# EasyEDA Pro project ESPGI-WIN.eprj, board PCB1
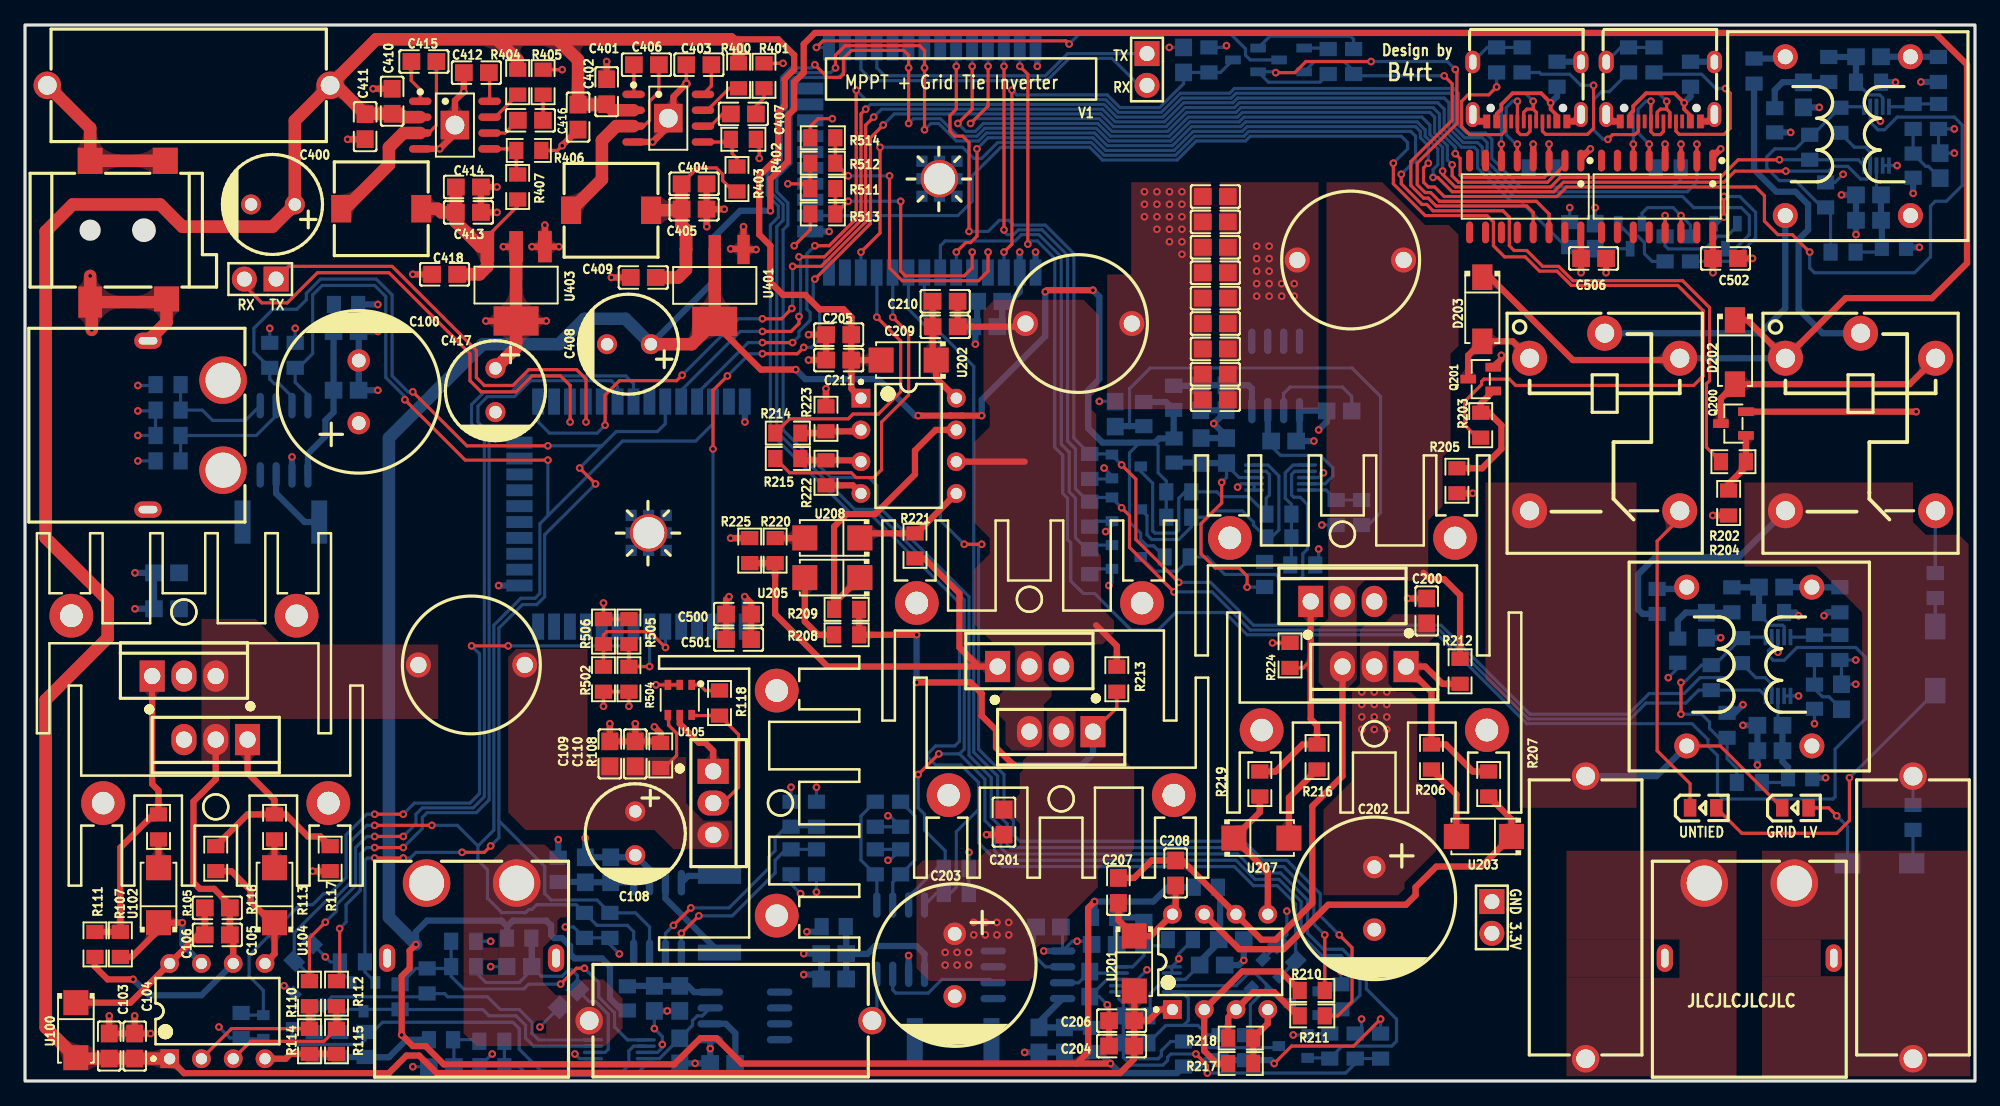
[diagram p6: board, top side]
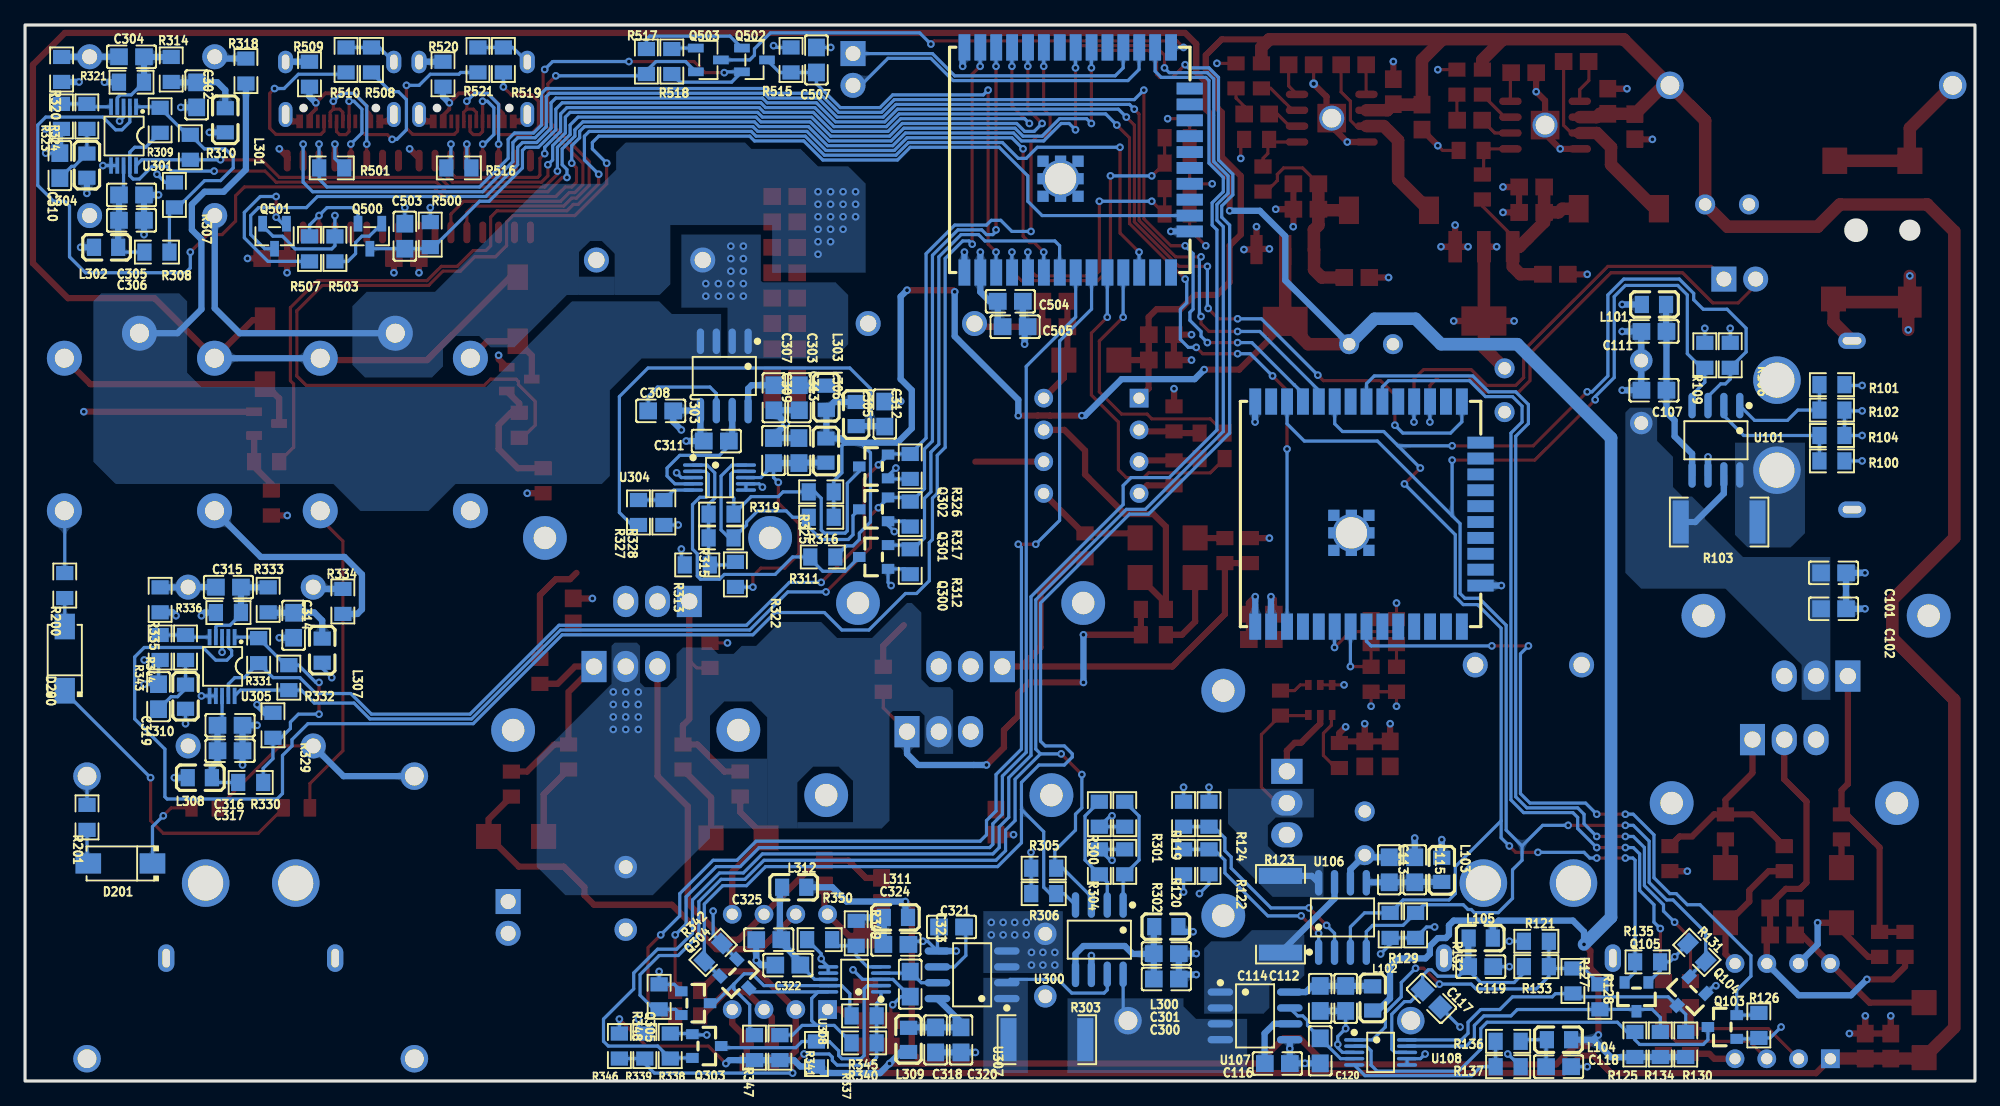
[diagram p7: board, bottom side, seen from below]

Outline 155.83 x 84.46 mm; copper layers: Top Layer, Inner1, Inner2, Bottom Layer. Coordinates in mm from the lower left corner of the outline.
Outline path: rectangle 0,84.46 155.83,0
Stack: Top Layer 0.035mm Outer layer thickness 1oz / Dielectric1 0.2104mm 7628 RC49% 8.6mil / Inner1 0.0152mm Inner layer thickness / Dielectric2 1.065mm 1.1mm H/HOZ Copper / Inner2 0.0152mm Inner layer thickness / Dielectric3 0.2104mm 7628 RC49% 8.6mil / Bottom Layer 0.035mm Outer layer thickness 1oz

## Design rules (mm)
template: JLCPCB Capability(Two Layers Board)
spacing copperThickness1oz (default): track to track 0.102, other pairs 0.152 to 0.3
spacing copperThickness2oz: track to track 0.203, other pairs 0.152 to 0.3
track width copperThickness1oz (default): min 0.127, default 0.254, max 2.54
track width copperThickness2oz: min 0.203, default 0.254, max 2.54
differential pair differentialPair (default): width min 0.127, default 0.254, max 2.54; gap min 0.152, default 0.152
via viaSize (default): diameter min 0.5, default 0.61, max 10; hole min 0.3, default 0.305, max 6.3

## Placement (name value [footprint] x y rotation side)
C100  470uF  [CAP-TH_BD13.0-P5.00-D0.6-FD]  26.67 55.12 90 top
C101  10uF  [C0805]  11.3 40.64 0 bottom
C102  100nF  [C0805]  11.3 37.77 0 bottom
C103  10uF  [C0805]  6.73 2.79 90 top
C104  100nF  [C0805]  8.76 2.79 90 top
C105  NC  [C0805]  15.37 13.84 180 top
C106  1uF  [C0805]  15.37 11.68 180 top
C107  100nF  [C0805]  25.65 55.25 0 bottom
C108  470uF  [CAP-TH_BD8.0-P3.50-D0.6-FD]  48.77 19.81 270 top
C109  22uF  [C0805]  46.74 26.16 90 top
C110  22uF  [C0805]  48.77 26.16 90 top
C111  10uF  [C0805]  25.65 59.94 0 bottom
C112  10uF  [C0805]  50.29 6.6 270 bottom
C113  100nF  [C0805]  46.8 16.89 90 bottom
C114  100nF  [C0805]  52.32 6.6 270 bottom
C115  10uF  [C0805]  44.77 16.89 90 bottom
C116  100nF  [C0805]  55.75 1.4 0 bottom
C117  100nF  [C0805]  43.43 6.6 45 bottom
C118  10uF  [C0805]  33.27 1.14 0 bottom
C119  10uF  [C0805]  39.5 9.14 0 bottom
C120  NC  [C0805]  52.32 2.41 90 bottom
C200  22uF  [C0805]  112.01 37.59 270 top
C201  22uF  [C0805]  78.23 20.7 90 top
C202  470uF  [CAP-TH_BD13.0-P5.00-D0.6-FD]  107.82 14.61 270 top
C203  2200uF  [CAP-TH_BD13.0-P5.00-D0.6-FD]  74.3 9.27 270 top
C204  1uF  [C0805]  87.63 2.79 180 top
C205  1uF  [C0805]  65.02 59.69 180 top
C206  100nF  [C0805]  87.63 4.83 180 top
C207  4.7uF  [C0805]  87.38 15.24 270 top
C208  1uF  [C0805]  91.95 16.64 270 top
C209  1uF  [C0805]  73.53 60.33 180 top
C210  4.7uF  [C0805]  73.53 62.36 180 top
C211  100nF  [C0805]  65.02 57.66 180 top
C212  10uF  [C0805]  95.12 70.74 180 top
C213  10uF  [C0805]  95.12 68.71 180 top
C214  10uF  [C0805]  95.12 66.68 180 top
C215  10uF  [C0805]  95.12 64.64 180 top
C216  10uF  [C0805]  95.12 62.61 180 top
C217  10uF  [C0805]  95.12 60.58 180 top
C218  10uF  [C0805]  95.12 58.55 180 top
C219  10uF  [C0805]  95.12 56.52 180 top
C220  10uF  [C0805]  95.12 54.48 180 top
C300  100nF  [C0805]  64.62 8.16 180 bottom
C301  10uF  [C0805]  64.62 10.19 180 bottom
C302  10uF  [C0805]  142.11 78.87 270 bottom
C303  10uF  [C0805]  93.95 54.64 270 bottom
C304  1uF  [C0805]  147.32 81.92 180 bottom
C305  100nF  [C0805]  147.32 70.87 0 bottom
C306  10uF  [C0805]  147.32 68.83 0 bottom
C307  100nF  [C0805]  95.98 54.64 270 bottom
C308  100nF  [C0805]  105.03 53.59 0 bottom
C309  100nF  [C0805]  96.02 50.42 270 bottom
C310  10uF  [C0805]  153.05 73.21 90 bottom
C311  NC  [C0805]  100.58 51.18 180 bottom
C312  10uF  [C0805]  87.12 53.34 270 bottom
C313  10uF  [C0805]  93.98 50.42 270 bottom
C314  10uF  [C0805]  134.37 36.45 270 bottom
C315  1uF  [C0805]  139.57 39.5 180 bottom
C316  100nF  [C0805]  139.45 28.45 0 bottom
C317  10uF  [C0805]  139.45 26.42 0 bottom
C318  10uF  [C0805]  83.06 3.29 270 bottom
C319  10uF  [C0805]  145.16 30.73 90 bottom
C320  100nF  [C0805]  81.03 3.29 270 bottom
C321  100nF  [C0805]  81.79 12.32 180 bottom
C322  100nF  [C0805]  94.87 9.27 180 bottom
C323  NC  [C0805]  85.09 7.75 90 bottom
C324  10uF  [C0805]  86.23 10.92 0 bottom
C325  10uF  [C0805]  96.39 11.3 180 bottom
C400  100uF  [CAP-TH_BD8.0-P3.50-D0.6-FD]  19.81 70.1 180 top
C401  10uF  [C0805]  46.48 79.12 90 top
C402  10uF  [C0805]  44.2 77.09 270 top
C403  100nF  [C0805]  53.85 81.28 0 top
C404  22uF  [C0805]  53.47 71.76 0 top
C405  22uF  [C0805]  53.47 69.72 0 top
C406  10nF  [C0805]  49.66 81.28 180 top
C407  3.9nF  [C0805]  57.4 77.34 180 top
C408  47uF  [CAP-TH_BD8.0-P3.50-D0.6-FD]  48.26 58.93 180 top
C409  100nF  [C0805]  49.4 64.26 0 top
C410  10uF  [C0805]  29.34 78.36 90 top
C411  10uF  [C0805]  27.18 76.33 270 top
C412  100nF  [C0805]  36.07 80.65 0 top
C413  22uF  [C0805]  35.43 69.47 0 top
C414  22uF  [C0805]  35.43 71.5 0 top
C415  10nF  [C0805]  31.88 81.53 180 top
C416  3.9nF  [C0805]  40.39 76.84 180 top
C417  47uF  [CAP-TH_BD8.0-P3.50-D0.6-FD]  37.59 55.25 270 top
C418  100nF  [C0805]  33.53 64.52 0 top
C500  100nF  [C0805]  57.02 37.34 0 top
C501  22uF  [C0805]  57.02 35.31 0 top
C502  100nF  [C0805]  135.89 65.79 0 top
C503  1uF  [C0805]  125.48 67.56 270 bottom
C504  100nF  [C0805]  77.09 62.36 180 bottom
C505  22uF  [C0805]  76.71 60.33 180 bottom
C506  100nF  [C0805]  125.35 65.79 0 top
C507  1uF  [C0805]  92.58 81.66 270 bottom
D200  1N4007  [SMA_L4.4-W2.8-LS5.4-RD]  152.65 33.78 90 bottom
D201  1N4007  [SMA_L4.4-W2.8-LS5.4-RD]  148.21 17.4 0 bottom
D202  1N4007  [SMA_L4.4-W2.8-LS5.4-RD]  136.65 58.29 270 top
D203  1N4007  [SMA_L4.4-W2.8-LS5.4-RD]  116.46 61.72 270 top
DC400  DC050-T  [DC-IN_DC050-T]  8.25 67.95 0 top
FH100  PTF-15  [FUSE-TH_L22.0-W9.0-P22.60]  56.39 4.83 0 top
FH200  PTF-15  [FUSE-TH_L22.0-W9.0-P22.60]  150.88 13.08 270 top
FH201  PTF-15  [FUSE-TH_L22.0-W9.0-P22.60]  124.71 13.08 270 top
FH400  PTF-15  [FUSE-TH_L22.0-W9.0-P22.60]  13.08 79.63 180 top
H500  PZ254V-11-02P  [HDR-TH_2P-P2.54-V-M]  18.8 64.14 180 top
H501  PZ254V-11-02P  [HDR-TH_2P-P2.54-V-M]  89.66 80.9 270 top
H502  PZ254V-11-02P  [HDR-TH_2P-P2.54-V-M]  117.22 13.08 270 top
L100  120uH  [IND-TH_XR6826T471MHL6]  35.69 33.27 0 top
L101  10uH  [L0805]  25.65 62.1 0 bottom
L102  10uH  [L0805]  48.13 6.6 270 bottom
L103  10uH  [L0805]  42.61 16.89 90 bottom
L104  10uH  [L0805]  33.24 3.3 180 bottom
L105  10uH  [L0805]  39.5 11.43 180 bottom
L200  200uH  [IND-TH_XR6826T471MHL6]  105.92 65.66 180 top
L201  0uH  [IND-TH_XR6826T471MHL6]  84.2 60.58 0 top
L300  10uH  [L0805]  64.62 12.35 180 bottom
L301  10uH  [L0805]  139.83 76.84 270 bottom
L302  10uH  [L0805]  149.35 66.68 0 bottom
L303  10uH  [L0805]  91.79 54.64 270 bottom
L304  10uH  [L0805]  150.89 73.21 270 bottom
L305  10uH  [L0805]  89.41 53.34 90 bottom
L306  10uH  [L0805]  91.83 50.42 90 bottom
L307  10uH  [L0805]  132.08 34.42 270 bottom
L308  10uH  [L0805]  141.86 24.26 0 bottom
L309  10uH  [L0805]  85.22 3.29 270 bottom
L310  10uH  [L0805]  143 30.73 270 bottom
L311  10uH  [L0805]  86.23 13.08 180 bottom
L312  10uH  [L0805]  94.36 15.49 180 bottom
L400  10uH  [IND-SMD_L7.5-W7.5]  46.83 69.64 180 top
L401  10uH  [IND-SMD_L7.5-W7.5]  28.47 69.76 180 top
LED200  red  [LED0805-R-RD]  134.11 21.84 0 top
LED201  green  [LED0805-R-RD]  141.48 21.84 0 top
Q100  IRL540NPBF  [TO-220-3_L10.0-W4.5-P2.54-T]  12.7 32.39 90 top
Q101  IRL540NPBF  [TO-220-3_L10.0-W4.5-P2.54-T]  54.99 22.23 0 top
Q102  IRL540NPBF  [TO-220-3_L10.0-W4.5-P2.54-T]  15.24 27.31 270 top
Q103  BSS138  [SOT-23_L2.9-W1.3-P1.90-LS2.4-BR]  20.19 4.32 180 bottom
Q104  BSS138  [SOT-23_L2.9-W1.3-P1.90-LS2.4-BR]  22.99 6.86 135 bottom
Q105  BSS138  [SOT-23_L2.9-W1.3-P1.90-LS2.4-BR]  27.05 6.73 90 bottom
Q200  BC847  [SOT-23-3_L2.9-W1.3-P1.90-LS2.4-BR]  136.52 52.58 0 top
Q201  BC847  [SOT-23-3_L2.9-W1.3-P1.90-LS2.4-BR]  116.33 56.13 0 top
Q202  IRL540NPBF  [TO-220-3_L10.0-W4.5-P2.54-T]  107.82 33.15 270 top
Q203  IRL540NPBF  [TO-220-3_L10.0-W4.5-P2.54-T]  82.8 27.94 270 top
Q204  IRL540NPBF  [TO-220-3_L10.0-W4.5-P2.54-T]  105.28 38.35 90 top
Q205  IRL540NPBF  [TO-220-3_L10.0-W4.5-P2.54-T]  80.26 33.15 90 top
Q300  BSS138  [SOT-23_L2.9-W1.3-P1.90-LS2.4-BR]  88.01 41.91 180 bottom
Q301  BSS138  [SOT-23_L2.9-W1.3-P1.90-LS2.4-BR]  88.01 45.72 180 bottom
Q302  BSS138  [SOT-23_L2.9-W1.3-P1.90-LS2.4-BR]  88.01 49.15 180 bottom
Q303  BSS138  [SOT-23_L2.9-W1.3-P1.90-LS2.4-BR]  101.35 2.79 0 bottom
Q304  BSS138  [SOT-23_L2.9-W1.3-P1.90-LS2.4-BR]  98.81 8.25 45 bottom
Q305  BSS138  [SOT-23_L2.9-W1.3-P1.90-LS2.4-BR]  102.23 6.22 0 bottom
Q500  BC847  [SOT-23-3_L2.9-W1.3-P1.90-LS2.4-BR]  128.27 67.56 90 bottom
Q501  BC847  [SOT-23-3_L2.9-W1.3-P1.90-LS2.4-BR]  135.89 67.56 90 bottom
Q502  BC847  [SOT-23-3_L2.9-W1.3-P1.90-LS2.4-BR]  97.54 81.66 0 bottom
Q503  BC847  [SOT-23-3_L2.9-W1.3-P1.90-LS2.4-BR]  101.22 81.66 0 bottom
R100  NC  [R0805]  11.43 49.59 0 bottom
R101  NC  [R0805]  11.43 55.69 0 bottom
R102  10k  [R0805]  11.43 53.66 0 bottom
R103  0.05  [R2512]  20.45 44.7 180 bottom
R104  10k  [R0805]  11.43 51.62 0 bottom
R105  0  [R0805]  10.67 20.32 90 top
R106  10k  [R0805]  19.56 58.04 270 bottom
R107  10  [R0805]  7.62 10.92 90 top
R108  NC  [R0805]  50.8 26.04 270 top
R109  10k  [R0805]  21.59 58.04 270 bottom
R110  0  [R0805]  22.73 6.99 270 top
R111  NC  [R0805]  5.59 10.92 90 top
R112  0  [R0805]  24.89 6.99 270 top
R113  0  [R0805]  19.94 20.32 90 top
R114  NC  [R0805]  22.73 3.18 90 top
R115  NC  [R0805]  24.89 3.18 90 top
R116  10  [R0805]  15.24 17.78 90 top
R117  NC  [R0805]  24.38 17.78 90 top
R118  100  [R0805]  55.5 30.23 90 top
R119  NC  [R0805]  63.25 21.34 270 bottom
R120  10k  [R0805]  63.25 17.53 90 bottom
R121  10k  [R0805]  35.05 11.18 180 bottom
R122  NC  [R0805]  61.21 17.53 90 bottom
R123  0.02  [R2512]  55.5 13.34 90 bottom
R124  10k  [R0805]  61.21 21.34 270 bottom
R125  10k  [R0805]  27.18 2.92 270 bottom
R126  10k  [R0805]  17.27 4.44 270 bottom
R127  NC  [R0805]  32.13 8 270 bottom
R128  NC  [R0805]  29.97 6.73 90 bottom
R129  10k  [R0805]  46.74 12.45 90 bottom
R130  10k  [R0805]  23.11 2.92 270 bottom
R131  10k  [R0805]  22.22 10.29 45 bottom
R132  10k  [R0805]  44.7 12.45 90 bottom
R133  NC  [R0805]  35.05 9.14 180 bottom
R134  10k  [R0805]  25.15 2.92 270 bottom
R135  10k  [R0805]  26.16 9.53 180 bottom
R136  10k  [R0805]  37.31 3.18 180 bottom
R137  10k  [R0805]  37.31 1.14 180 bottom
R200  2k  [R0805]  152.65 39.62 90 bottom
R201  2k  [R0805]  150.88 21.08 90 bottom
R202  1k  [R0805]  136.52 49.53 0 top
R203  1k  [R0805]  116.33 52.45 90 top
R204  10k  [R0805]  136.14 46.23 90 top
R205  10k  [R0805]  114.43 48.01 90 top
R206  0  [R0805]  112.39 25.91 90 top
R207  10  [R0805]  116.97 23.75 90 top
R208  0  [R0805]  65.66 35.69 0 top
R209  10  [R0805]  65.66 37.72 0 top
R210  0  [R0805]  102.87 7.24 180 top
R211  0  [R0805]  102.87 5.21 180 top
R212  NC  [R0805]  114.68 32.77 270 top
R213  NC  [R0805]  87.25 32.13 270 top
R214  0  [R0805]  60.96 51.82 0 top
R215  0  [R0805]  60.96 49.78 0 top
R216  0  [R0805]  103.25 25.91 90 top
R217  NC  [R0805]  97.15 1.4 180 top
R218  NC  [R0805]  97.15 3.43 180 top
R219  10  [R0805]  98.68 23.75 90 top
R220  0Ω  [R0805]  59.94 42.42 270 top
R221  10  [R0805]  71.12 42.8 270 top
R222  NC  [R0805]  64.01 48.64 90 top
R223  NC  [R0805]  64.01 52.96 270 top
R224  NC  [R0805]  101.09 34.04 270 top
R225  NC  [R0805]  57.91 42.42 270 top
R300  NC  [R0805]  69.98 21.34 90 bottom
R301  10k  [R0805]  67.95 21.34 90 bottom
R302  NC  [R0805]  67.95 17.53 270 bottom
R303  0.02  [R2512]  74.17 3.3 180 bottom
R304  10k  [R0805]  69.98 17.53 270 bottom
R305  10k  [R0805]  74.42 17.02 180 bottom
R306  10k  [R0805]  74.42 14.99 180 bottom
R307  NC  [R0805]  143.89 70.87 270 bottom
R308  10k  [R0805]  145.29 66.29 0 bottom
R309  NC  [R0805]  145.03 76.84 90 bottom
R310  NC  [R0805]  142.62 74.68 90 bottom
R311  10k  [R0805]  92.08 41.91 180 bottom
R312  10k  [R0805]  85.09 41.53 270 bottom
R313  NC  [R0805]  102.11 41.28 180 bottom
R314  100k  [R0805]  144.14 80.9 90 bottom
R315  NC  [R0805]  100.2 43.43 180 bottom
R316  10k  [R0805]  92.2 45.09 180 bottom
R317  10k  [R0805]  85.09 45.34 270 bottom
R318  5k  [R0805]  138.18 80.77 270 bottom
R319  10k  [R0805]  100.2 45.34 0 bottom
R320  750  [R0805]  152.91 80.9 270 bottom
R321  100k  [R0805]  147.32 79.88 0 bottom
R322  NC  [R0805]  99.06 40.51 90 bottom
R323  100k  [R0805]  152.92 77.15 270 bottom
R324  100k  [R0805]  150.89 77.15 270 bottom
R325  10k  [R0805]  92.2 47.12 180 bottom
R326  10k  [R0805]  85.09 49.15 270 bottom
R327  10k  [R0805]  106.81 45.47 270 bottom
R328  10k  [R0805]  104.77 45.47 270 bottom
R329  NC  [R0805]  136.02 28.45 270 bottom
R330  NC  [R0805]  137.8 23.88 0 bottom
R331  NC  [R0805]  137.16 34.42 90 bottom
R332  10k  [R0805]  134.75 32.26 90 bottom
R333  100k  [R0805]  136.4 38.48 90 bottom
R334  5k  [R0805]  130.43 38.35 270 bottom
R335  750  [R0805]  145.03 38.48 270 bottom
R336  100k  [R0805]  139.57 37.47 0 bottom
R337  10k  [R0805]  92.58 2.16 270 bottom
R338  10k  [R0805]  104.27 2.79 90 bottom
R339  10k  [R0805]  106.3 2.79 270 bottom
R340  NC  [R0805]  88.77 3.05 0 bottom
R341  10k  [R0805]  95.5 2.67 270 bottom
R342  10k  [R0805]  100.84 10.29 135 bottom
R343  100k  [R0805]  145.03 34.67 270 bottom
R344  100k  [R0805]  143 34.67 270 bottom
R345  NC  [R0805]  88.77 5.21 180 bottom
R346  NC  [R0805]  108.33 2.79 270 bottom
R347  10k  [R0805]  97.54 2.67 270 bottom
R348  10k  [R0805]  105.16 6.73 90 bottom
R349  10k  [R0805]  89.41 11.81 90 bottom
R350  10k  [R0805]  92.33 11.3 0 bottom
R400  100k  [R0805]  57.02 80.39 90 top
R401  6.8k  [R0805]  59.05 80.39 270 top
R402  10k  [R0805]  57.4 75.31 0 top
R403  60k  [R0805]  56.9 72.14 270 top
R404  100k  [R0805]  39.37 79.88 90 top
R405  6.8k  [R0805]  41.4 79.88 270 top
R406  10k  [R0805]  40.26 74.42 0 top
R407  42.2k  [R0805]  39.37 71.5 270 top
R500  10k  [R0805]  123.44 67.69 270 bottom
R501  10k  [R0805]  131.32 73.03 0 bottom
R502  NTC  [R0805]  46.23 32.13 270 top
R503  10k  [R0805]  131.06 66.55 270 bottom
R504  NTC  [R0805]  48.26 32.13 270 top
R505  10k  [R0805]  48.26 35.94 90 top
R506  10k  [R0805]  46.23 35.94 90 top
R507  10k  [R0805]  133.1 66.55 270 bottom
R508  5.1k  [R0805]  128.14 81.66 270 bottom
R509  NC  [R0805]  133.1 80.52 270 bottom
R510  5.1k  [R0805]  130.18 81.66 270 bottom
R511  NTC  [R0805]  63.75 71.37 0 top
R512  NTC  [R0805]  63.75 73.41 0 top
R513  10k  [R0805]  63.75 69.34 180 top
R514  10k  [R0805]  63.75 75.44 180 top
R515  10k  [R0805]  94.61 81.66 270 bottom
R516  10k  [R0805]  121.16 73.03 0 bottom
R517  10k  [R0805]  106.17 81.53 90 bottom
R518  10k  [R0805]  104.14 81.53 90 bottom
R519  5.1k  [R0805]  117.6 81.66 270 bottom
R520  NC  [R0805]  122.43 80.52 270 bottom
R521  5.1k  [R0805]  119.63 81.66 270 bottom
RLY200  SRD-05VDC-SL-C  [RELAY-TH_SRD-XXVDC-XL-C]  146.69 52.71 270 top
RLY201  SRD-05VDC-SL-C  [RELAY-TH_SRD-XXVDC-XL-C]  126.24 52.71 270 top
U100  SS34  [SMA_L4.3-W2.6-LS5.1-RD]  4.06 4.06 270 top
U101  INA219BID  [SOIC-8_L4.9-W3.9-P1.27-LS6.0-BL]  20.7 51.24 0 bottom
U102  SS34  [SMA_L4.3-W2.6-LS5.1-RD]  10.67 14.86 90 top
U103  IR2103PBF  [DIP-8_L9.8-W6.6-P2.54-LS7.6-BL]  15.37 5.59 0 top
U104  SS34  [SMA_L4.3-W2.6-LS5.1-RD]  19.94 14.86 90 top
U105  LM5050MK-1/NOPB  [TSOT-23-6_L2.9-W1.6-P0.95-LS2.8-BR]  52.32 30.48 90 top
U106  INA219BID  [SOIC-8_L4.9-W3.9-P1.27-LS6.0-BL]  50.55 13.08 180 bottom
U107  ACS724LLCTR-05AB-T  [SOIC-8_L4.9-W3.9-P1.27-LS6.0-BL]  57.53 5.21 270 bottom
U108  ADS1115IDGSR  [MSOP-10_L3.0-W3.0-P0.50-LS5.0-BL]  47.5 2.29 270 bottom
U109  XT60PW-F  [TH_2P-XT60PW-F]  12.83 52.45 90 top
U110  XT60PW-F  [TH_2P-XT60PW-F]  35.69 12.83 180 top
U200  XT60PW-F  [TH_2P-XT60PW-F]  137.8 12.83 180 top
U201  SS34  [SMA_L4.3-W2.6-LS5.1-RD]  88.65 9.4 270 top
U202  SS34  [SMA_L4.3-W2.6-LS5.1-RD]  70.61 57.66 180 top
U203  SS34  [SMA_L4.3-W2.6-LS5.1-RD]  116.59 19.56 180 top
U204  IR2103PBF  [DIP-8_L9.8-W6.6-P2.54-LS7.6-BL]  95.5 9.53 0 top
U205  SS34  [SMA_L4.3-W2.6-LS5.1-RD]  64.52 40.26 180 top
U206  IR2103PBF  [DIP-8_L9.8-W6.6-P2.54-LS7.6-BL]  70.61 50.8 270 top
U207  SS34  [SMA_L4.3-W2.6-LS5.1-RD]  98.81 19.43 0 top
U208  SS34  [SMA_L4.3-W2.6-LS5.1-RD]  64.52 43.43 180 top
U300  INA219BID  [SOIC-8_L4.9-W3.9-P1.27-LS6.0-BL]  69.98 11.3 0 bottom
U301  ADS1015IDGST  [VSSOP-10_L3.0-W3.0-P0.50-LS4.9-BL]  147.95 75.57 0 bottom
U302  ZMPT101B  [XFMR-TH_ZMPT101B]  145.67 75.57 0 top
U303  ACS724LLCTR-10AB-T  [SOIC-8_L4.9-W3.9-P1.27-LS6.0-BL]  99.95 56.39 0 bottom
U304  ADS1115IDGSR  [MSOP-10_L3.0-W3.0-P0.50-LS5.0-BL]  100.33 48.26 270 bottom
U305  ADS1015IDGST  [VSSOP-10_L3.0-W3.0-P0.50-LS4.9-BL]  140.08 33.15 0 bottom
U306  ZMPT101B  [XFMR-TH_ZMPT101B]  137.8 33.15 0 top
U307  ACS724LLCTR-10AB-T  [SOIC-8_L4.9-W3.9-P1.27-LS6.0-BL]  80.14 8.49 90 bottom
U308  ADS1115IDGSR  [MSOP-10_L3.0-W3.0-P0.50-LS5.0-BL]  89.53 8.13 90 bottom
U400  MP2307DN-LF-Z  [SOP-8_L4.9-W3.9-P1.27-LS6.0-BL-EP]  51.4 77 270 top
U401  AMS1117-5.0  [SOT-223-3_L6.7-W3.7-P2.30-LS7.0-BR]  55.12 63.63 90 top
U402  MP2307DN-LF-Z  [SOP-8_L4.9-W3.9-P1.27-LS6.0-BL-EP]  34.36 76.45 270 top
U403  AMS1117-3.3  [SOT-223-3_L6.5-W3.4-P2.30-LS7.0-BR]  39.24 63.75 90 top
U500  ESP32-WROOM-32E-N4  [WIFI-SMD_ESP32-WROOM-32E]  48.51 45.34 180 bottom
U501  CH340C  [SOP-16_L10.0-W3.9-P1.27-LS6.0-BL]  130.43 70.74 180 top
U502  ESP32-WROOM-32E-N4  [WIFI-SMD_ESP32-WROOM-32E]  71.75 73.66 180 bottom
U503  CH340C  [SOP-16_L10.0-W3.9-P1.27-LS6.0-BL]  119.89 70.74 180 top
U504  -  [HEATSINK-TH_L23.5-W16.0-P18.0_XSD2156-067]  12.7 37.21 0 top
U504#2  -  [HEATSINK-TH_L23.5-W16.0-P18.0_XSD2156-067]  15.24 22.23 180 top
U504#3  -  [HEATSINK-TH_L23.5-W16.0-P18.0_XSD2156-067]  105.28 43.43 0 top
U504#4  -  [HEATSINK-TH_L23.5-W16.0-P18.0_XSD2156-067]  107.82 28.07 180 top
U504#5  -  [HEATSINK-TH_L23.5-W16.0-P18.0_XSD2156-067]  82.8 22.86 180 top
U504#6  -  [HEATSINK-TH_L23.5-W16.0-P18.0_XSD2156-067]  80.26 38.23 0 top
U504#7  -  [HEATSINK-TH_L23.5-W16.0-P18.0_XSD2156-067]  60.07 22.23 270 top
USB500  TYPE-C 16PIN 2MD(073)  [USB-C-SMD_TYPE-C-6PIN-2MD-073]  130.68 79.12 180 top
USB501  TYPE-C 16PIN 2MD(073)  [USB-C-SMD_TYPE-C-6PIN-2MD-073]  120.02 79.12 180 top

## Footprints (pads in the part's own frame, mm; a bottom-side part is the same pattern mirrored in y, then rotated)
C0805
  rect 1.41x1.35 smd: 1(-1,0) 2(1,0)
CAP-TH_BD8.0-P3.50-D0.6-FD
  round 1.6 hole 1: 1(-1.75,0) 2(1.75,0)
CAP-TH_BD13.0-P5.00-D0.6-FD
  round 1.8 hole 1.1: 1(-2.5,0) 2(2.5,0)
DC-IN_DC050-T
  rect 2x2.1 smd: 1(-3.05,5.65) 1(2.95,5.65)
  rect 1.9x2.5 smd: 2(-3.05,-5.65)
  rect 2x2 smd: 3(3.05,-5.4)
DIP-8_L9.8-W6.6-P2.54-LS7.6-BL
  rect 1.5x1.5 hole 0.9: 1(-3.81,-3.81)
  round 1.5 hole 0.9: 2(-1.27,-3.81) 3(1.27,-3.81) 4(3.81,-3.81) 5(3.81,3.81) 6(1.27,3.81) 7(-1.27,3.81) 8(-3.81,3.81)
FUSE-TH_L22.0-W9.0-P22.60
  round 2.2 hole 1.5: 1(-11.3,0) 2(11.3,0)
HDR-TH_2P-P2.54-V-M
  rect 2x2 hole 1.2: 1(-1.27,0)
  round 2 hole 1.2: 2(1.27,0)
HEATSINK-TH_L23.5-W16.0-P18.0_XSD2156-067
  round 3.5 hole 1.8: 1(-9,0) 2(9,0)
IND-SMD_L7.5-W7.5
  rect 1.6x2.2 smd: 1(-3.2,0) 2(3.2,0)
IND-TH_XR6826T471MHL6
  round 2 hole 1.3: 1(-4.25,0) 2(4.25,0)
L0805
  rect 1.133x1.377 smd: 1(-0.966,0) 2(0.966,0)
LED0805-R-RD
  rect 1x1.399 smd: 1(1.05,0) 2(-1.05,0)
MSOP-10_L3.0-W3.0-P0.50-LS5.0-BL
  oval 0.28x1.62 smd: 1(-1,-2.11) 2(-0.5,-2.11) 3(0,-2.11) 4(0.5,-2.11) 5(1,-2.11) 6(1,2.11) 7(0.5,2.11) 8(0,2.11) 9(-0.5,2.11) 10(-1,2.11)
R0805
  rect 1.133x1.377 smd: 1(-1,0) 2(1,0)
R2512
  rect 1.282x3.456 smd: 1(-3.067,0) 2(3.067,0)
RELAY-TH_SRD-XXVDC-XL-C
  round 2.794 hole 1.524: 1(-5.1,-6) 2(7.1,-6) 3(7.1,6) 4(-5.1,6) 5(-7.1,0)
SMA_L4.3-W2.6-LS5.1-RD
  rect 2x2 smd: 1(-2.2,0) 2(2.2,0)
SMA_L4.4-W2.8-LS5.4-RD
  rect 2.046x1.62 smd: 1(-2.566,0) 2(2.566,0)
SOIC-8_L4.9-W3.9-P1.27-LS6.0-BL
  oval 0.588x2.045 smd: 1(-1.905,-2.772) 2(-0.635,-2.772) 3(0.635,-2.772) 4(1.905,-2.772) 5(1.905,2.772) 6(0.635,2.772) 7(-0.635,2.772) 8(-1.905,2.772)
SOP-8_L4.9-W3.9-P1.27-LS6.0-BL-EP
  oval 0.6x1.8 smd: 1(-1.905,-2.772) 2(-0.635,-2.772) 3(0.635,-2.772) 4(1.905,-2.772) 5(1.905,2.772) 6(0.635,2.772) 7(-0.635,2.772) 8(-1.905,2.772)
  rect 2.29x2.29 smd: 9(0,0)
  round 2 hole 1.5: 10(0,0)
SOP-16_L10.0-W3.9-P1.27-LS6.0-BL
  oval 0.56x1.745 smd: 1(-4.445,-2.873) 2(-3.175,-2.873) 3(-1.905,-2.873) 4(-0.635,-2.873) 5(0.635,-2.873) 6(1.905,-2.873) 7(3.175,-2.873) 8(4.445,-2.873) 9(4.445,2.873) 10(3.175,2.873) 11(1.905,2.873) 12(0.635,2.873) 13(-0.635,2.873) 14(-1.905,2.873) 15(-3.175,2.873) 16(-4.445,2.873)
SOT-23-3_L2.9-W1.3-P1.90-LS2.4-BR
  rect 1.25x0.7 smd: 1(1,-0.95) 2(1,0.95) 3(-1,0)
SOT-23_L2.9-W1.3-P1.90-LS2.4-BR
  rect 1x0.8 smd: 1(1.15,-0.95) 2(1.15,0.95) 3(-1.15,0)
SOT-223-3_L6.5-W3.4-P2.30-LS7.0-BR
  rect 2.5x1.1 smd: 1(2.97,-2.3) 2(2.97,0) 3(2.97,2.3)
  rect 2.34x3.6 smd: 4(-2.97,0)
SOT-223-3_L6.7-W3.7-P2.30-LS7.0-BR
  rect 2.34x0.98 smd: 1(2.87,-2.3) 2(2.87,0) 3(2.87,2.3)
  rect 2.34x3.6 smd: 4(-2.87,0)
TH_2P-XT60PW-F
  oval 1.3x2.2 hole 0.6x1.5: 1(-6.75,3) 2(6.75,3)
  round 3.8 hole 2.8: 3(-3.6,-3) 4(3.6,-3)
TO-220-3_L10.0-W4.5-P2.54-T
  rect 2.5x2 hole 1.3: 1(0,2.54)
  oval 2.5x2 hole 1.3: 2(0,0) 3(0,-2.54)
TSOT-23-6_L2.9-W1.6-P0.95-LS2.8-BR
  rect 0.8x0.532 smd: 1(1.2,-0.95) 2(1.2,0) 3(1.2,0.95) 4(-1.2,0.95) 5(-1.2,0) 6(-1.2,-0.95)
USB-C-SMD_TYPE-C-6PIN-2MD-073
  rect 0.55x1.1 smd: 1(-3.2,2.375) 2(-2.4,2.375) 11(2.4,2.375) 12(3.2,2.375)
  rect 0.3x1.1 smd: 3(-1.75,2.375) 4(-1.25,2.375) 5(-0.75,2.375) 6(-0.25,2.375) 7(0.25,2.375) 8(0.75,2.375) 9(1.25,2.375) 10(1.75,2.375)
  oval 1.1x2 hole 0.6x1.5: 13(-4.325,1.825) 14(4.325,1.825)
  oval 1.2x1.8 hole 0.6x1.2: 13(-4.325,-2.375) 14(4.325,-2.375)
VSSOP-10_L3.0-W3.0-P0.50-LS4.9-BL
  rect 0.3x1.3 smd: 1(-1,-2.35) 2(-0.5,-2.35) 3(0,-2.35) 4(0.5,-2.35) 5(1,-2.35) 6(1,2.35) 7(0.5,2.35) 8(0,2.35) 9(-0.5,2.35) 10(-1,2.35)
WIFI-SMD_ESP32-WROOM-32E
  rect 0.95x2.1 smd: 1(-9.002,-9) 2(-7.732,-9) 3(-6.463,-9) 4(-5.192,-9) 5(-3.922,-9) 6(-2.652,-9) 7(-1.383,-9) 8(-0.113,-9) 9(1.157,-9) 10(2.428,-9) 11(3.697,-9) 12(4.968,-9) 13(6.237,-9) 14(7.508,-9) 25(7.508,9) 26(6.237,9) 27(4.968,9) 28(3.697,9) 29(2.428,9) 30(1.157,9) 31(-0.113,9) 32(-1.383,9) 33(-2.652,9) 34(-3.922,9) 35(-5.192,9) 36(-6.463,9) 37(-7.732,9) 38(-9.002,9)
  rect 2.1x0.95 smd: 15(9.002,-5.715) 16(9.002,-4.445) 17(9.002,-3.175) 18(9.002,-1.905) 19(9.002,-0.635) 20(9.002,0.635) 21(9.002,1.905) 22(9.002,3.175) 23(9.002,4.445) 24(9.002,5.715)
  rect 0.9x0.9 smd: 39(-2.721,-2.9) 39(-2.721,-1.5) 39(-2.721,-0.1) 39(-1.321,-2.9) 39(-1.321,-1.5) 39(-1.321,-0.1) 39(0.079,-2.9) 39(0.079,-1.5) 39(0.079,-0.1)
  round 3 hole 2.5: 40(-1.319,-1.5)
XFMR-TH_ZMPT101B
  round 2 hole 1.2: 1(-5,6.35) 2(-5,-6.35) 3(5,-6.35) 4(5,6.35)

## Nets
As in the schematic, except:
+3.3V: C417.1 C500.1 C501.1 C502.1 C504.1 C505.1 C506.1 H502.2 L101.2 L103.2 L300.2 L301.2 L302.2 L304.2 L307.2 L308.2 L310.2 Q103.1 Q104.1 Q105.1 Q300.1 Q301.1 Q302.1 Q303.1 Q304.1 Q305.1 R100.1 R101.1 R106.1 R109.1 R119.1 R120.1 R126.2 R129.1 R131.2 R132.1 R135.2 R300.1 R301.1 R305.1 R306.1 R312.2 R317.2 R326.2 R338.2 R342.2 R348.2 R500.1 R501.1 R502.2 R504.2 R511.1 R512.1 R515.1 R516.1 U403.2 U403.4 U500.2 U501.4 U501.16 U502.2 U503.4 U503.16
GND: C100.2 C101.1 C102.1 C103.2 C104.2 C107.2 C108.2 C109.2 C110.2 C111.2 C112.2 C113.2 C114.2 C115.2 C116.1 C117.1 C118.1 C119.1 C120.1 C200.1 C201.1 C202.2 C203.2 C204.2 C205.2 C206.2 C211.2 C300.2 C301.2 C302.2 C303.2 C305.1 C306.1 C307.2 C308.1 C309.1 C310.2 C311.1 C312.1 C313.1 C314.2 C316.1 C317.1 C318.2 C319.2 C320.2 C321.1 C322.1 C323.1 C324.1 C325.1 C400.2 C401.2 C402.2 C403.1 C404.2 C405.2 C409.1 C410.2 C411.2 C412.1 C413.2 C414.2 C417.2 C418.1 C500.2 C501.2 C502.2 C503.1 C504.2 C505.2 C506.2 C507.1 DC400.2 DC400.3 H502.1 Q102.3 Q200.2 Q201.2 Q204.3 Q205.3 R102.1 R104.1 R108.1 R114.1 R115.1 R117.1 R121.1 R122.1 R124.1 R137.2 R204.1 R205.1 R217.1 R218.1 R222.1 R223.1 R224.1 R225.1 R302.1 R304.1 R307.1 R313.1 R320.2 R321.2 R323.2 R328.2 R329.1 R335.2 R336.2 R339.1 R343.2 R350.2 R401.1 R402.2 R405.1 R406.2 R505.2 R506.2 R508.1 R509.1 R510.1 R513.2 R514.2 R519.1 R520.1 R521.1 U101.6 U103.4 U105.2 U105.3 U106.6 U107.5 U108.3 U108.6 U108.7 U109.1 U109.2 U109.4 U110.1 U110.2 U110.4 U200.1 U200.2 U204.4 U206.4 U300.6 U301.3 U301.6 U301.7 U302.3 U303.5 U304.3 U304.6 U304.7 U305.3 U305.6 U305.7 U306.3 U307.5 U308.3 U308.6 U308.7 U400.4 U400.9 U400.10 U401.1 U402.4 U402.9 U402.10 U403.1 U500.1 U500.15 U500.38 U500.39 U500.40 U501.1 U502.1 U502.15 U502.38 U502.39 U502.40 U503.1 USB500.1 USB500.12 USB500.13 USB500.14 USB501.1 USB501.12 USB501.13 USB501.14

Pads without a net: C408 2; U500 4 5 9 10 11 12 13 14 16 17 18 19 20 21 22 23 24 26 29 32 37; U501 7 8 9 10 11 12 15; U502 13 14 17 18 19 20 21 22 23 24 29 32; U503 7 8 9 10 11 12 15; U504 1 2; U504#2 1 2; U504#3 1 2; U504#4 1 2; U504#5 1 2; U504#6 1 2; U504#7 1 2; USB500 3 9; USB501 3 9

## Via types
v1: diameter 0.61, hole 0.305, Top Layer to Bottom Layer, 374 vias
v2: diameter 0.7, hole 0.35, Top Layer to Bottom Layer, 1 via

## Routing (per net, layer and track width the routed paths; a pad name or vN(x,y) marks a point on that pad's centre or on a via; arc(x,y) is an arc through that point)
+3.3V: length 115
  Top Layer w0.254: v1(60.96,71.76) 62.37,71.76 R511.1 R512.1 ; v1(46.23,29.97) R502.2 R504.2 v1(48.26,29.97)
  Top Layer w0.5: v1(124.35,64.64) C506.1 124.33,65.8 U503.16 ; v1(134.89,64.64) C502.1 134.87,65.8 U501.16 ; v1(56.26,38.73) 56.02,38.5 C500.1 C501.1 ; v1(41.66,60.78) U403.4 v1(36.83,60.78) ; U501.4 v1(131.06,74.93) ; U503.4 v1(120.52,74.93) ; U403.2 v1(38.23,66.72)
  Top Layer w1.001: U403.2 U403.4 39.24,58.65 C417.1
  Bottom Layer w0.254: v1(15.49,4.32) 16.37,3.44 R126.2 17.35,3.37 Q103.1 ; R500.1 v1(123.44,69.85) ; v1(131.06,74.93) 131.06,73.77 R501.1 ; R317.2 85.52,44.77 86.86,44.77 86.86,44.44 v1(86.36,43.94) ; v1(105.16,8.76) R348.2 103.94,7.73 Q305.1 ; L307.2 132.08,33.02 v1(131.32,32.26) ; v1(101.35,3.68) 102.43,3.68 Q303.1 102.55,3.79 R338.2 ; R312.2 85.52,40.96 86.86,40.96 86.86,39.87 v1(86.61,39.62) ; R301.1 R300.1 69.1,21.21 v1(68.96,21.21) ; R119.1 v1(63.25,23.5) ; L310.2 v1(143,28.58) ; R101.1 10.37,55.63 v1(9.02,55.63) ; R106.1 v1(19.56,60.2) ; Q105.1 25.16,8.82 R135.2 24.4,9.53 v1(24,9.93) R131.2 ; v1(96.01,82.8) 95.87,82.66 R515.1 ; v1(86.23,49.02) 86.86,48.39 86.86,48.2 86.81,48.15 R326.2 ; v1(100.84,13.59) 100.84,11.7 R342.2 100.13,10.92 Q304.1 ; R109.1 v1(21.59,60.2) ; v1(43.18,12.32) 43.83,12.32 R132.1 R129.1 46.74,10.92 v1(47.5,10.16) ; R516.1 120.52,73.39 v1(120.52,74.93) ; v1(75.44,18.29) 75.44,17.03 R305.1 R306.1 ; Q104.1 20.88,7.62 v1(20.7,7.62) ; R120.1 v1(63.25,15.11) ; R100.1 v1(9.02,49.59)
  Bottom Layer w0.5: L300.2 63.25,11.94 v1(62.48,11.94) ; v1(56.26,38.73) 56.26,36.35 U500.2 ; 42.61,17.86 v1(42.61,19.3) ; L101.2 v1(28.19,62.1) ; L302.2 v1(151.38,66.68) ; L308.2 v1(143.89,24.26) ; 139.83,75.87 v1(141.1,75.87) ; L304.2 v1(150.89,70.99) ; v1(79.49,66.29) U502.2 79.49,63.1 78.74,62.36 C504.1 78.09,60.71 C505.1
+5V: length 503.5
  Top Layer w0.254: v1(99.82,1.4) 101.22,2.79 106.17,2.79 v1(108.33,4.95)
  Top Layer w0.5: v1(59.56,69.6) 59.56,72.14 60.96,73.53 60.96,77.22 61.47,77.72 61.47,79.88 62.23,80.65 62.23,82.93 63.12,83.82 152.65,83.82 155.19,81.28 155.19,65.41 152.4,62.61 145.49,62.61 RLY200.1 137.63,60.86 D202.1 ; v1(85.34,63.25) 81.66,63.25 v1(81.53,63.12) ; v1(71.37,53.21) 73.94,53.21 73.95,53.22 74.9,53.22 74.91,53.21 v1(76.45,53.21) ; v1(31.24,10.92) 30.73,10.41 30.73,9.02 30.1,8.38 v1(30.1,3.68) 30.99,2.79 32,2.79 33.46,1.33 51.88,1.33 53.97,3.43 55.24,3.43 57.28,1.4 84.05,1.4 ; v1(61.59,56.9) 58.8,56.9 55.12,60.58 ; D203.1 117.07,64.29 123.7,57.66 132.09,57.66 RLY201.4 ; 84.05,1.4 v1(86.74,1.4) ; 84.05,1.4 84.96,2.31 84.96,13.84 v1(85.47,14.35)
  Top Layer w1: 55.12,66.5 U401.4 53.29,58.93 C408.1
  Bottom Layer w0.254: R316.2 R325.2 91.2,47.99 90.55,48.64 90.55,50.8 90.3,51.05 ; R346.1 v1(108.33,4.95) ; 89.08,51.05 88.27,50.24 88.27,44.7 89.15,43.82 89.15,43.31 89.66,42.8 90.19,42.8 R311.2
  Bottom Layer w0.5: L305.2 91.16,54.31 L303.2 91.79,51.42 L306.2 90.63,51.39 90.3,51.05 86.11,51.05 84.96,52.2 84.96,55.25 85.85,56.13 85.85,62.74 v1(85.34,63.25) ; C408.1 55.12,64.04 55.12,67.56 57.15,69.6 v1(59.56,69.6) ; 38.53,11.43 38.53,12.37 ; 38.53,12.37 38.07,12.83 32.13,12.83 31.24,11.94 v1(31.24,10.92) ; 38.53,12.37 38.99,12.83 41.66,12.83 42.04,12.45 42.04,11.68 42.29,11.43 42.93,11.43 43.56,10.8 43.56,10.16 43.91,9.81 46.1,9.81 46.75,9.16 46.75,6.6 47.72,5.64 L102.2 ; v1(61.59,56.9) 62.36,56.13 68.2,56.13 71.12,53.21 v1(71.37,53.21) ; R130.2 R134.2 R125.2 27.19,1.91 29.08,1.91 30.48,3.3 ; L312.2 91.31,15.49 90.17,14.35 v1(85.47,14.35) 85.47,13.28 L311.2 ; v1(99.82,1.4) 99.55,1.67 R347.2 R341.2 94.38,1.67 93.87,1.16 R337.2 92.06,0.64 87.5,0.64 v1(86.74,1.4) 85.82,2.32 L309.2 ; 30.48,3.3 v1(30.1,3.68) ; 30.48,3.3 L104.2 ; v1(81.53,63.12) 81.53,59.56 76.45,54.48 v1(76.45,53.21) ; RLY201.4 RLY200.1
  Bottom Layer w1: v1(31.24,10.92) 29.08,13.08 29.08,51.44 36.58,58.93 42.67,58.93 44.7,60.96 47.98,60.96 C408.1
+12V: length 299.5
  Top Layer w0.5: U206.1 66.04,55.37 66.04,57.64 C211.1 ; C206.1 C204.1 88.63,1.76 87.5,0.64 32.89,0.64 31.5,2.03 30.48,2.03 29.07,0.63 12.71,0.63 U103.1 ; C206.1 88.65,4.84 U201.2 ; C206.1 89.79,4.83 90.68,5.72 U204.1 ; C211.1 U202.2 ; C211.1 C205.1 66.04,59.71 66.04,61.09 65.4,61.72 63.5,61.72 62.36,62.87 60.58,62.87 59.56,63.88 59.56,66.8 58.67,67.69 58.67,72.39 60.2,73.91 60.2,77.47 60.71,77.98 60.71,80.14 61.47,80.9 61.47,82.04 60.2,83.31 56.39,83.31
  Top Layer w1: 24.38,79.63 21.56,76.81 C400.1 19.78,68.33 12.57,68.33 10.8,70.1 3.81,70.1 1.65,67.95 1.65,43.43 6.6,38.48 6.6,35.43 1.65,30.48 1.65,4.28 U100.2 4.13,1.79 C103.1 C104.1 11.54,1.79 U103.1 ; 24.38,79.63 28.06,83.31 37.72,83.31 ; 24.38,79.63 24.88,79.63 C411.1 27.21,77.36 C410.1 29.96,77.36 30.23,77.09 U402.2 ; R404.2 39.37,81.66 37.72,83.31 ; R400.2 57.02,82.68 56.39,83.31 42.55,83.31 ; 37.72,83.31 42.55,83.31 ; U400.2 46.96,77.64 C401.1 46.45,78.09 C402.1 44.2,81.66 42.55,83.31
GND: length 323.1
  Top Layer w0.254: R514.2 62.75,76.34 63.37,76.96 v1(64.52,76.96) ; v1(86.49,6.1) 86.63,5.95 C206.2 ; v1(46.23,38.23) R506.2 R505.2 ; v1(42.93,74.8) 42.55,74.42 R406.2 ; v1(58.67,73.79) 58.67,75.04 R402.2 ; R224.1 v1(99.7,35.04) ; U105.2 U105.3 v1(50.42,31.68) ; R405.1 v1(42.93,80.88) ; v1(61.47,66.8) 62.75,68.09 R513.2 ; C403.1 v2(52.85,79.76) ; R401.1 v1(60.58,81.39)
  Top Layer w0.5: USB500.13 134.46,76.75 USB500.1 ; C502.2 v1(138.05,65.79) ; U403.1 v1(42.67,66.72) ; U403.1 v1(41.54,68.45) ; U403.1 v1(40.51,66.72) ; v1(6.73,5.21) C103.2 C104.2 ; USB501.14 116.24,76.75 116.81,76.75 ; R205.1 v1(115.7,47.01) ; v1(135.51,74.55) 134.87,73.91 U501.1 ; v1(42.93,74.8) 42.93,74.82 C402.2 ; C501.2 C500.2 58.02,38.23 v1(57.52,38.73) ; 57.42,66.5 57.37,66.55 v1(56.39,66.55) ; 57.42,66.5 v1(58.42,66.5) ; 57.42,66.5 v1(57.42,68.33) ; R204.1 v1(134.87,45.23) ; v1(117.98,58.04) 117.98,57.73 Q201.2 ; v1(46.74,28.58) C109.2 C110.2 ; v1(62.61,59.69) C205.2 C211.2 v1(62.61,57.66) ; C410.2 v1(27.81,79.36) ; v2(52.85,79.76) 51.82,78.72 51.82,77.42 U400.9 51.4,76.34 v1(50.16,75.1) U400.4 ; C110.2 50.67,27.16 R108.1 50.8,27.81 v1(50.29,28.32) ; C110.2 v1(48.77,28.58) ; v1(37.72,69.47) C413.2 C414.2 v1(37.72,71.5) ; C409.1 v1(46.86,64.26) ; U402.4 33.14,74.55 v1(33.15,74.55) 34.36,75.76 U402.9 34.36,78.41 v1(35.07,79.12) C412.1 ; v1(125.09,74.55) 124.33,73.79 U503.1 ; R222.1 66.15,47.64 U206.4 ; C404.2 C405.2 ; C405.2 v1(55.88,69.72) ; C405.2 54.47,68.34 v1(54.48,68.33) ; C411.2 27.16,75.31 v1(25.78,75.31) ; C104.2 v1(8.76,5.21) ; C104.2 v1(10.03,3.79) ; C201.1 v1(76.83,19.7) ; R117.1 v1(22.99,16.78) ; R223.1 v1(64.01,55.37) ; U103.4 20.83,1.78 21.22,2.18 R114.1 R115.1 ; C401.2 v1(46.48,81.53) ; 127.48,76.75 126.91,76.75 USB500.14 ; C200.1 v1(110.49,38.59) ; USB501.1 123.79,76.75 USB501.13 ; Q200.2 v1(151.13,53.53) ; C206.2 C204.2 ; R225.1 v1(56.39,43.42) ; C418.1 v1(30.99,64.52) ; R217.1 R218.1 99.31,4.59 U204.4 ; C506.2 v1(126.35,64.64)
  Top Layer w1: DC400.2 v1(5.2,64.39) ; DC400.2 5.33,62.17 v1(5.33,60.07) ; DC400.2 11.05,62.3 DC400.3 11.3,60.68 U109.2
  Bottom Layer w0.254: C503.1 v1(125.48,69.85) ; U301.7 U301.6 v1(149.61,73.22) ; R302.1 R304.1 69.1,17.65 v1(68.96,17.65) ; v1(141.73,30.8) U305.6 U305.7 ; v1(86.49,6.1) 85.84,6.75 C323.1 86.47,8.13 88.9,8.13 v1(89.66,8.89) ; R350.2 92.2,10.18 v1(92.2,9.78) 92.2,9.69 U308.6 U308.7 ; v1(103.76,48.64) 103.38,48.26 U304.3 ; R122.1 61.21,15.75 v1(61.98,14.99) ; v1(146.3,33.67) R343.2 145.16,33.54 C319.2 v1(146.3,31.73) ; R510.1 R508.1 127.52,82.66 USB500.14 ; U305.3 v1(140.08,34.29) ; v1(103.38,42.55) 103.38,41.55 R313.1 ; U301.3 147.95,77.09 v1(148.27,76.77) ; C112.2 v1(50.29,4.19) 50.93,3.56 v1(50.93,2.92) 50.93,2.67 50.55,2.29 U108.3 ; C312.1 87.11,54.36 v1(85.85,54.36) ; C507.1 v1(91.44,82.66) ; v1(96.9,47.5) 97.16,47.76 U304.7 U304.6 ; v1(154.18,76.15) R323.2 152.92,74.34 C310.2 v1(154.18,74.21) ; R124.1 v1(61.21,23.5) ; C118.1 v1(30.99,1.14) ; R307.1 144.64,71.87 v1(145.29,72.52) ; R328.2 v1(103.63,44.47) ; C119.1 v1(37.21,9.14) ; C321.1 82.92,12.19 U307.5 83.69,11.18 v1(84.07,11.18) 84.98,11.18 C324.1 ; v1(106.81,4.95) 106.81,4.3 R339.1 ; v1(9.02,51.62) R104.1 R102.1 10.37,53.59 v1(9.02,53.59) ; C117.1 v1(41.15,4.32) ; U108.6 U108.7 44.31,1.79 v1(43.94,2.16) ; v1(37.34,2.16) 37.32,2.16 R137.2 ; R521.1 R519.1 116.86,82.66 USB501.14 ; R121.1 v1(37.21,11.18)
  Bottom Layer w0.5: v1(8.79,40.64) C101.1 C102.1 v1(8.79,37.77) ; R509.1 134.99,81.52 USB500.13 ; R336.2 141.48,37.47 v1(141.73,37.21) ; v1(146.32,67.69) C306.1 C305.1 v1(145.16,70.87) ; v1(143.76,37.21) 144.03,37.48 R335.2 ; U107.5 v1(54.76,2.59) 54.76,1.4 C116.1 54.74,1.41 v1(53.55,1.41) C120.1 ; v1(79.88,2.29) C320.2 C318.2 ; R520.1 124.32,81.52 USB501.13 ; U500.38 57.53,54.32 v1(57.53,52.71) ; U101.6 v1(21.34,49.91) ; C302.2 v1(143.38,77.87) ; U502.38 80.9,82.52 v1(80.9,81.15) ; v1(28.19,55.25) C107.2 26.67,55.26 C100.2 26.67,59.93 C111.2 v1(28.19,59.94) ; C313.1 C309.1 96.02,51.56 v1(95,52.58) 95.98,53.57 C307.2 C303.2 ; v1(44.77,19.43) C115.2 C113.2 48.6,17.89 C108.2 49.91,16.92 U106.6 ; U500.1 v1(57.52,38.73) ; U300.6 v1(70.61,10.03) ; C322.1 97.01,9.27 v1(97.39,9.65) C325.1 ; v1(103.38,52.07) 104.03,52.72 C308.1 104.01,53.62 U303.5 101.85,51.45 C311.1 v1(103,51.18) ; v1(62.23,10.19) C301.2 C300.2 63.27,8.51 v1(62.23,8.51) ; R320.2 v1(151.51,79.9) ; R321.2 v1(149.48,79.88) ; U502.1 v1(80.76,66.29) ; v1(137.29,30.1) 136.64,29.45 R329.1 ; U500.15 v1(37.85,39.62) ; C314.2 v1(135.51,35.45) ; v1(137.29,28.45) C316.1 C317.1 v1(138.45,25.27) ; U502.15 v1(64.26,67.95) ; C112.2 v1(51.32,5.6) C114.2 ; C504.2 76.09,60.71 C505.2 75.95,60.09 v1(75.95,58.93) ; U307.5 v1(81.41,10.4)
BAT-P: length 3.9
  Bottom Layer w0.254: U300.8 68.07,5.21 FH100.2
FIL-L: length 48.6
  Top Layer w0.5: R212.1 114.68,38.86 113.41,40.13 112.27,40.13 111.76,40.64 ; Q202.3 105.28,24.38 102.87,21.97 102.87,14.22 99.95,11.3 98.81,11.3 U204.6 92.47,17.64 C208.1 90.03,17.64 88.63,16.24 C207.1
FIL-N: length 17
  Top Layer w0.5: R213.1 87.25,34.8 85.6,36.45 ; C210.1 C209.1 79.7,60.33 L201.1 ; U206.6 79.88,49.53
GRID-LV-L: length 20.7
  Bottom Layer w0.254: R201.2 150.88,24.38
  Bottom Layer w0.5: R334.2 129.27,37.35 128.9,37.72 128.9,40.51 130.3,41.91 136.99,41.91 140.69,45.61
GRID-LV-N: length 18.8
  Top Layer w0.254: LED201.2 135.47,26.8 U306.2
  Bottom Layer w0.5: 124.71,24.38 130.38,24.38 U306.2
GTI-BOOT: length 39.9
  Top Layer w0.254: v1(63.25,82.66) 63.77,83.19 83.18,83.19 v1(83.44,82.93)
  Bottom Layer w0.254: Q503.3 97.92,81.66 97.54,82.04 97.54,82.55 96.27,83.82 84.33,83.82 v1(83.44,82.93) ; U502.25 v1(63.25,82.66)
GTI-EN: length 35.2
  Top Layer w0.254: v1(78.87,79.25) 78.87,66.93 v1(78.23,66.29)
  Bottom Layer w0.254: v1(78.87,79.25) 79.25,78.87 86.49,78.87 87.5,77.85 90.68,77.85 92.58,79.76 C507.2 R515.2 95.54,80.66 Q502.3 ; v1(78.23,66.29) 78.23,64.67 U502.3
GTI-G-ALERT: length 139.2
  Top Layer w0.254: v1(80.14,66.93) 80.14,80.52 v1(79.5,81.15)
  Bottom Layer w0.254: U305.2 139.58,34.68 139.32,34.42 139.32,34.04 139.7,33.66 140.59,33.66 141.61,34.67 146.3,34.67 147.07,33.91 147.07,28.96 144.65,26.54 144.65,22.73 144.47,22.55 135.69,22.55 135.25,22.99 135.25,26.04 134.49,26.8 134.49,27.31 133.22,28.58 120.02,28.58 112.9,35.69 97.66,35.69 95.89,37.47 91.95,37.47 90.55,36.07 88.39,36.07 85.47,38.99 84.58,38.99 83.57,40.01 83.57,43.05 83.31,43.31 83.31,46.61 82.93,46.99 82.93,50.04 82.3,50.67 82.3,65.79 80.9,67.18 80.39,67.18 v1(80.14,66.93) ; U502.37 79.5,82.65 v1(79.5,81.15)
GTI-H-ALERT: length 126.9
  Bottom Layer w0.254: Q303.2 104.22,1.84 R338.1 105.27,2.79 109.22,2.79 109.6,3.18 109.6,4.95 107.19,7.37 107.19,8.64 105.28,10.54 103.76,10.54 102.49,11.81 102.49,14.48 100.33,16.64 98.42,16.64 96.9,18.16 78.49,18.16 77.98,18.67 77.98,20.32 77.22,21.08 77.22,24.26 75.44,26.04 75.44,38.73 68.07,46.1 68.07,47.62 67.44,48.26 64.39,48.26 60.58,52.07 60.58,68.07 60.96,68.45 60.96,70.23 60.07,71.12 60.07,72.26 61.21,73.41 61.21,80.01 61.47,80.26 65.02,80.26 65.52,80.76 U502.26
GTI-HIN-L: length 82.6
  Top Layer w0.254: R210.1 v1(103.87,11.68)
  Bottom Layer w0.254: U502.8 71.87,61.1 75.82,57.15 75.82,26.29 77.72,24.38 77.72,21.34 78.49,20.57 78.49,18.92 78.74,18.67 97.15,18.67 98.68,17.15 100.58,17.15 103,14.73 103,12.56 v1(103.87,11.68)
GTI-HIN-N: length 21.7
  Top Layer w0.254: R214.1 61.1,52.96 65.79,52.96 66.17,53.34 68.2,53.34 69.98,55.12 69.98,59.18 v1(68.07,61.09)
  Bottom Layer w0.254: v1(68.07,61.09) 68.07,64.65 U502.11
GTI-I-ALERT: length 39.3
  Bottom Layer w0.254: 86.86,42.86 85.42,42.86 R312.1 84.85,42.53 83.95,43.43 83.95,46.61 83.44,47.12 83.44,50.29 82.8,50.93 82.8,65.91 81.03,67.69 79.63,67.69 79.12,67.18 73.53,67.18 73.15,66.8 73.15,64.67 U502.7
GTI-NLIN-L: length 88.3
  Top Layer w0.254: v1(76.45,42.93) v1(75.06,42.93) ; v1(105.03,11.68) 106.05,10.67 106.05,6.35 104.9,5.21 R211.1
  Bottom Layer w0.254: v1(76.45,42.93) 76.2,42.67 76.2,26.54 78.23,24.51 78.23,21.59 78.99,20.83 78.99,19.69 79.5,19.18 97.41,19.18 98.93,17.65 100.84,17.65 103.5,14.99 103.5,13.21 v1(105.03,11.68) ; U502.9 70.6,61.74 73.15,59.18 73.15,44.83 v1(75.06,42.93)
GTI-NLIN-N: length 26.6
  Top Layer w0.254: v1(69.34,61.09) 70.61,59.82 70.61,54.86 68.45,52.71 68.45,48.9 67.82,48.26 66.42,48.26 66.04,48.64 61.1,48.64 R215.1
  Bottom Layer w0.254: U502.10 69.34,64.65 v1(69.34,61.09)
GTI-P-1: length 9.9
  Bottom Layer w0.254: U307.2 77.1,8.13 73.28,8.13 72.18,7.03 69.6,7.03 69.34,7.28 U300.7
GTI-P-2:
  vias: v1(73.53,10.29) v1(73.53,9.27) v1(74.49,10.29) v1(74.49,9.27) v1(75.4,10.29) v1(75.4,9.27) v1(75.82,12.68) v1(75.82,11.68) v1(76.74,12.68) v1(76.74,11.68) v1(77.67,12.68) v1(77.67,11.68) v1(78.61,12.68) v1(78.61,11.68) v1(106.82,31.12) v1(106.82,30.12) v1(106.82,29.12) v1(106.82,28.12) v1(107.82,31.12) v1(107.82,30.12) v1(107.82,29.12) v1(107.82,28.12) v1(108.82,31.12) v1(108.82,30.12) v1(108.82,29.12) v1(108.82,28.12)
GTI-RELAY-L: length 103
  Top Layer w0.254: v1(109.98,72.52) 109.98,71.76 111.63,70.1 112.01,70.1 112.52,69.6 118.11,69.6 118.62,69.09 118.62,66.8 119,66.42 120.02,66.42 121.28,65.15 122.55,65.15 123.7,64.01 132.46,64.01 134.62,61.85 134.62,56.01 134.37,55.75 134.37,50.69 R202.1 ; v1(66.8,66.29) 68.33,67.82 v1(68.33,74.68)
  Bottom Layer w0.254: v1(109.98,72.52) 111.12,73.66 111.12,75.57 110.74,75.95 97.79,75.95 97.41,75.57 93.47,75.57 91.95,74.04 86.23,74.04 85.22,75.06 77.72,75.06 76.45,73.79 75.82,73.79 74.93,74.68 v1(68.33,74.68) ; U502.12 66.8,64.67 v1(66.8,66.29)
GTI-RELAY-N: length 115.7
  Top Layer w0.254: v1(109.35,73.41) 109.35,71.76 111.89,69.22 116.84,69.22 117.35,68.71 117.35,66.8 118.24,65.91 119.89,65.91 121.03,64.77 122.43,64.77 123.57,63.63 132.08,63.63 134.11,61.59 134.11,56.39 133.35,55.63 119.13,55.63 118.62,56.13 116.59,56.13 116.4,55.94 116.4,55.69 115.06,54.36 115.06,52.45 116.06,51.45 R203.1
  Bottom Layer w0.254: v1(109.35,73.41) 110.49,74.55 110.49,75.06 109.98,75.57 97.92,75.57 97.54,75.18 93.6,75.18 92.08,73.66 86.11,73.66 85.09,74.68 77.98,74.68 75.69,72.39 75.69,70.36 74.55,69.22 U502.16
GTI-RX: length 62
  Top Layer w0.254: v1(114.05,73.28) 114.05,72.39 114.55,71.88 121.67,71.88 123.06,73.28 U503.2 ; v1(74.55,76.58) 75.69,77.72 v1(75.69,81.15)
  Bottom Layer w0.254: U502.34 75.69,82.65 v1(75.69,81.15) ; v1(74.55,76.58) 75.18,75.95 75.95,75.95 76.58,76.58 85.73,76.58 86.74,75.57 91.44,75.57 92.96,77.09 96.9,77.09 97.28,77.47 112.27,77.47 112.65,77.09 112.65,75.82 113.67,74.8 113.67,73.66 v1(114.05,73.28)
GTI-SCL-1: length 105.5
  Top Layer w0.254: v1(78.23,68.07) v1(78.23,81.15) ; v1(91.82,39.12) 88.27,42.67 88.27,45.21 v1(87.63,45.85)
  Bottom Layer w0.254: v1(78.23,68.07) 78.23,67.95 78.49,67.69 78.99,67.69 79.37,68.07 81.28,68.07 83.31,66.04 83.31,51.18 83.95,50.55 83.95,47.37 84.98,46.34 R317.1 85.42,46.67 86.86,46.67 86.86,46.62 v1(87.63,45.85) ; v1(91.82,39.12) 94.87,39.12 97.92,36.07 113.03,36.07 120.14,28.96 128.27,28.96 129.54,30.23 132.71,30.23 133.75,31.26 R332.1 138.62,31.26 U305.10 ; U502.36 78.23,82.65 v1(78.23,81.15)
GTI-SCL-2: length 221.6
  Top Layer w0.254: v1(63.12,81.28) 64.14,80.26 65.15,80.26 65.4,80.52 65.4,81.79 66.04,82.42 70.23,82.42 70.61,82.04 v1(70.61,81.03) v1(70.61,76.58) ; v1(113.28,72.77) 113.28,72.52 114.3,71.5 121.92,71.5 122.68,72.26 135.49,72.26 136.91,73.68 v1(140.21,73.68)
  Bottom Layer w0.254: 76.2,21.72 74.42,19.94 74.42,15.49 73.91,14.99 R306.2 72.79,14.99 U300.4 ; 76.2,21.72 76.2,23.88 74.8,25.27 72.77,25.27 72.14,25.91 72.14,26.16 72.77,26.8 74.3,26.8 74.68,27.18 74.68,38.23 67.56,45.34 66.04,45.34 59.56,51.82 59.56,68.45 60.2,69.09 60.2,69.98 59.31,70.87 59.31,72.52 60.45,73.66 60.45,80.26 61.21,81.03 62.86,81.03 v1(63.12,81.28) ; 76.2,21.72 76.2,19.05 78.11,17.15 96.65,17.15 98.17,15.62 100.08,15.62 101.55,14.15 R342.1 100.36,8.4 Q304.2 ; v1(70.61,81.03) 70.61,82.65 U502.30 ; v1(70.61,76.58) 70.99,76.96 73.15,76.96 74.55,75.57 76.07,75.57 76.71,76.2 85.6,76.2 86.61,75.18 91.57,75.18 93.09,76.71 97.03,76.71 97.41,77.09 111.63,77.09 112.27,76.45 112.27,75.69 113.28,74.68 v1(113.28,72.77) ; U301.10 146.49,73.68 R310.1 v1(140.21,73.68)
GTI-SDA-1: length 111.6
  Top Layer w0.254: v1(87.63,49.28) 88.77,48.13 88.77,43.31 v1(92.2,39.88) ; v1(75.44,67.95) 75.44,75.06 74.93,75.57 74.3,75.57 73.91,75.95 73.91,77.22 74.42,77.72 v1(74.42,81.15)
  Bottom Layer w0.254: v1(87.63,49.28) 86.86,50.05 86.86,50.1 86.81,50.15 R326.1 83.82,51.42 83.82,66.17 81.53,68.45 78.99,68.45 78.61,68.83 77.85,68.83 76.96,67.95 v1(75.44,67.95) ; U502.33 74.42,82.65 v1(74.42,81.15) ; v1(92.2,39.88) 94.74,39.88 98.17,36.45 113.16,36.45 120.27,29.34 128.14,29.34 129.79,30.99 132.59,30.99 133.86,32.26 136,32.26 R331.1 138.32,32.26 139.06,32.26 139.58,31.74 U305.9
GTI-SDA-2: length 238
  Top Layer w0.254: v1(140.72,72.77) 136.65,72.77 135.76,71.88 122.94,71.88 122.17,71.12 114.05,71.12 112.9,72.26 v1(112.52,72.26) ; v1(73.02,26.16) v1(71.37,24.51) ; v1(71.88,76.07) v1(71.88,81.03) 71.88,82.42 71.5,82.8 65.53,82.8 64.77,82.04 v1(64.77,81.03)
  Bottom Layer w0.254: v1(140.72,72.77) 144.14,72.77 144.53,73.15 145.67,73.15 146.69,72.14 147.19,72.14 147.45,72.4 U301.9 147.45,74.29 147.07,74.68 146.19,74.68 R309.1 ; 103.39,5.27 103.84,5.73 R348.1 105.55,5.73 106.68,6.86 106.68,8.51 105.16,10.03 103.63,10.03 101.98,11.68 101.98,14.35 100.2,16.13 98.3,16.13 96.77,17.65 78.23,17.65 77.47,18.42 77.47,20.07 76.71,20.83 76.71,24.13 74.68,26.16 ; U300.3 70.61,14.73 72.9,17.02 R305.2 73.53,17.13 73.53,18.42 71.88,20.07 71.88,21.34 71.37,21.84 v1(71.37,24.51) ; v1(64.77,81.03) 64.39,80.65 61.34,80.65 60.83,80.14 60.83,73.53 59.69,72.39 59.69,70.99 60.58,70.1 60.58,68.83 60.07,68.33 60.07,51.94 66.29,45.72 67.82,45.72 75.06,38.48 75.06,26.54 74.68,26.16 ; U502.31 71.88,82.65 v1(71.88,81.03) ; v1(71.88,76.07) 72.39,76.58 73.02,76.58 74.42,75.18 76.2,75.18 76.83,75.82 85.47,75.82 86.49,74.8 91.69,74.8 93.22,76.33 97.15,76.33 97.54,76.71 111.25,76.71 111.89,76.07 111.89,75.57 112.9,74.55 112.9,73.28 112.52,72.9 v1(112.52,72.26) ; 74.68,26.16 v1(73.02,26.16)
GTI-TX: length 63
  Top Layer w0.254: v1(114.3,74.17) 114.68,73.79 114.68,72.44 114.86,72.26 121.41,72.26 121.79,72.64 U503.3 v1(121.79,74.93) ; v1(75.56,76.58) 76.96,77.98 v1(76.96,81.15)
  Bottom Layer w0.254: v1(76.96,81.15) 76.96,82.65 U502.35 ; R516.2 121.79,73.39 v1(121.79,74.93) ; v1(75.56,76.58) 75.95,76.96 85.85,76.96 86.87,75.95 91.31,75.95 92.84,77.47 96.77,77.47 97.15,77.85 112.52,77.85 113.03,77.34 113.03,75.95 114.3,74.68 v1(114.3,74.17)
GTI-U-ALERT: length 120.7
  Top Layer w0.254: v1(74.42,66.29) 75.18,67.06 75.56,67.06 76.07,67.56 v1(76.07,74.55) ; v1(112.14,73.41) 111.76,73.03 111.76,71.88 112.14,71.5 112.65,71.5 113.41,70.74 122.43,70.74 123.19,71.5 138.3,71.5 139,70.8 139,68.77 140.08,67.69 141.22,67.69 v1(142.62,66.29)
  Bottom Layer w0.254: U502.6 74.42,64.67 v1(74.42,66.29) ; v1(142.62,66.29) 142.62,65.02 143,64.64 151,64.64 152.27,65.91 152.27,69.98 152.65,70.36 153.54,70.36 154.81,71.63 154.81,76.45 154.18,77.09 149.61,77.09 148.59,76.07 148.08,76.07 147.45,76.7 U301.2 ; v1(112.14,73.41) 112.14,74.8 111.51,75.44 111.51,75.95 111.12,76.33 97.66,76.33 97.28,75.95 93.34,75.95 91.82,74.42 86.36,74.42 85.34,75.44 76.96,75.44 v1(76.07,74.55)
INVERT-L:
  vias: v1(98.42,66.77) v1(98.42,65.77) v1(98.42,64.77) v1(98.42,63.77) v1(98.42,62.77) v1(99.42,66.77) v1(99.42,65.77) v1(99.42,64.77) v1(99.42,63.77) v1(99.42,62.77) v1(100.42,63.77) v1(100.42,62.77) v1(101.42,63.77) v1(101.42,62.77)
INVERT-L-2: length 26.8
  Bottom Layer w0.5: R318.2 138.18,72.9 139.95,71.12 141.48,71.12 142.49,70.1 142.49,68.07 141.73,67.31 141.73,61.72 143.65,59.81 RLY200.5
INVERT-N: length 22.7
  Bottom Layer w0.5: RLY201.5 138.67,59.81 140.67,61.8 U302.2
  vias: v1(89.46,71.12) v1(89.46,70.12) v1(89.46,69.12) v1(90.46,71.12) v1(90.46,70.12) v1(90.46,69.12) v1(90.46,68.12) v1(91.46,71.12) v1(91.46,70.12) v1(91.46,69.12) v1(91.46,68.12) v1(91.46,67.12) v1(92.46,71.12) v1(92.46,70.12) v1(92.46,69.12) v1(92.46,68.12) v1(92.46,67.12) v1(92.46,66.12)
MPPT-ALERT: length 59.2
  Top Layer w0.254: v1(27.94,21.34) v1(30.23,21.34) ; v1(35.69,34.8) v1(38.61,34.8)
  Bottom Layer w0.254: v1(38.61,34.8) 48.26,34.8 48.63,35.16 U500.8 ; v1(35.69,34.8) 36.32,34.16 36.32,22.99 35.56,22.23 31.11,22.23 v1(30.23,21.34) ; v1(27.94,21.34) 27.3,21.34 25.65,19.69 25.65,16.26 24.38,14.99 23.88,14.99 22.99,14.1 21.97,14.1 17.91,10.03 17.91,8.38 19.04,7.25 Q103.2 17.45,5.27 R126.1
MPPT-BOOT: length 128.4
  Top Layer w0.254: v1(61.28,61.79) 60.45,60.96 v1(58.93,60.96) ; v1(67.82,77.09) 67.18,76.45 67.18,68.71 63.63,65.15 v1(61.34,65.15) ; v1(52.51,56.45) 52.07,56.01 47.5,56.01 46.35,54.86 v1(46.35,52.45)
  Bottom Layer w0.254: v1(61.34,65.15) 61.34,61.85 v1(61.28,61.79) ; v1(46.35,52.45) 45.72,51.82 41.91,51.82 41.01,52.72 U500.25 ; v1(58.93,60.96) 57.02,60.96 v1(52.51,56.45) ; v1(67.82,77.09) 68.45,77.72 86.11,77.72 87.12,76.71 91.06,76.71 92.58,78.23 96.52,78.23 96.9,78.61 113.41,78.61 113.79,78.23 113.79,76.2 114.93,75.06 116.08,75.06 116.46,74.68 116.46,73.28 119,70.74 132.46,70.74 133.35,69.85 137.16,69.85 137.8,69.22 137.8,67.69 136.67,66.56 Q501.3
MPPT-EN: length 116.7
  Top Layer w0.254: v1(68.58,76.45) 67.56,75.44 67.56,68.58 v1(63.12,64.14) ; v1(54.98,50.55) 54.98,55.23 v1(56.13,56.39) ; v1(62.23,58.67) 61.72,58.17 v1(58.93,58.17)
  Bottom Layer w0.254: v1(56.13,56.39) 57.91,58.17 v1(58.93,58.17) ; v1(54.98,50.55) U500.3 ; v1(63.12,64.14) 62.99,64.01 62.99,62.23 63.5,61.72 63.5,59.31 62.86,58.67 v1(62.23,58.67) ; v1(68.58,76.45) 69.47,77.34 85.98,77.34 86.99,76.33 91.19,76.33 92.71,77.85 96.65,77.85 97.03,78.23 112.9,78.23 113.41,77.72 113.41,76.07 114.81,74.68 115.82,74.68 116.08,74.42 116.08,73.03 118.74,70.36 119.51,70.36 123.17,66.69 R500.2 123.57,66.56 C503.2 Q500.3
MPPT-HIN: length 72
  Top Layer w0.254: R110.1 22.73,11.43 v1(24,12.7) ; v1(27.94,19.56) v1(30.23,19.56)
  Bottom Layer w0.254: U500.31 48.63,55.77 48.01,56.39 40.13,56.39 38.86,55.12 36.7,55.12 35.69,54.1 35.69,52.58 36.7,51.56 36.7,22.73 35.81,21.84 31.75,21.84 31.24,21.34 31.24,20.57 v1(30.23,19.56) ; v1(27.94,19.56) 27.3,19.56 26.42,18.67 26.42,15.62 24.89,14.1 24.89,13.59 v1(24,12.7)
MPPT-NLIN: length 68.8
  Top Layer w0.254: R112.1 25.15,8.24 v1(25.15,12.19) ; v1(27.94,18.67) v1(30.23,18.67)
  Bottom Layer w0.254: U500.30 47.36,55.51 46.86,56.01 40.39,56.01 39.12,54.74 36.96,54.74 36.19,53.98 36.19,52.71 37.08,51.82 37.08,22.48 36.07,21.46 32.13,21.46 31.75,21.08 31.75,20.19 v1(30.23,18.67) ; v1(25.15,12.19) 25.65,12.7 25.65,14.1 26.8,15.24 26.8,18.16 27.3,18.67 v1(27.94,18.67)
MPPT-P-1: length 14.4
  Top Layer w0.254: Q101.2 55.75,22.23 57.02,23.5 57.02,27.7 R118.1 53.33,29.23 U105.6
  Bottom Layer w0.5: U106.8 53,16.4 R123.2
MPPT-P-2: length 7.4
  Bottom Layer w0.5: R123.1 51.18,14.59 U106.7
MPPT-RX: length 111.2
  Top Layer w0.254: v1(58.93,59.94) 61.21,59.94 61.85,60.58 v1(61.85,61.14) ; v1(67.18,77.72) 66.8,77.34 66.8,68.83 63.88,65.91 v1(61.85,65.91) ; U501.2 v1(133.6,74.93)
  Bottom Layer w0.254: v1(61.85,65.91) 61.98,65.79 61.98,61.27 v1(61.85,61.14) ; U500.34 52.44,55.23 57.15,59.94 v1(58.93,59.94) ; v1(67.18,77.72) 67.56,78.11 86.23,78.11 87.25,77.09 90.93,77.09 92.46,78.61 96.39,78.61 96.77,78.99 113.92,78.99 114.17,78.74 114.17,76.33 115.06,75.44 116.46,75.44 116.84,75.06 116.84,73.53 119.25,71.12 132.84,71.12 133.6,71.88 v1(133.6,74.93)
MPPT-SCL: length 135
  Top Layer w0.254: v1(27.94,20.45) v1(32.51,20.45) ; v1(30.35,54.48) 35.18,49.66 v1(41.78,49.66)
  Bottom Layer w0.254: 22.85,8.34 21.61,9.58 ; v1(32.51,20.45) 34.54,20.45 36.19,18.8 ; U101.4 22.61,54.86 21.59,55.88 R109.2 21.86,57.04 22.99,58.17 22.99,62.87 23.75,63.63 27.94,63.63 28.83,62.74 28.83,56.26 30.35,54.74 v1(30.35,54.48) ; v1(27.94,20.45) 27.3,20.45 26.03,19.18 26.03,15.88 24.64,14.48 24.13,14.48 21.52,11.87 R131.1 ; 36.19,18.8 36.19,17.65 36.96,16.89 36.96,14.61 38.1,13.46 40,13.46 40.26,13.72 40.51,13.72 40.89,14.1 44.05,14.1 R132.2 45.7,12.45 48.13,12.45 48.64,11.94 U106.4 ; 36.19,18.8 37.46,20.07 37.46,36.45 39.62,38.61 40.77,38.61 41.15,38.99 41.15,44.58 41.78,45.21 ; U500.36 54.98,52.56 53.59,51.18 47.75,51.18 41.78,45.21 ; 41.78,45.21 v1(41.78,49.66)
